# EAGLE design RobotWagenSchema (EAGLE 9.6.2)
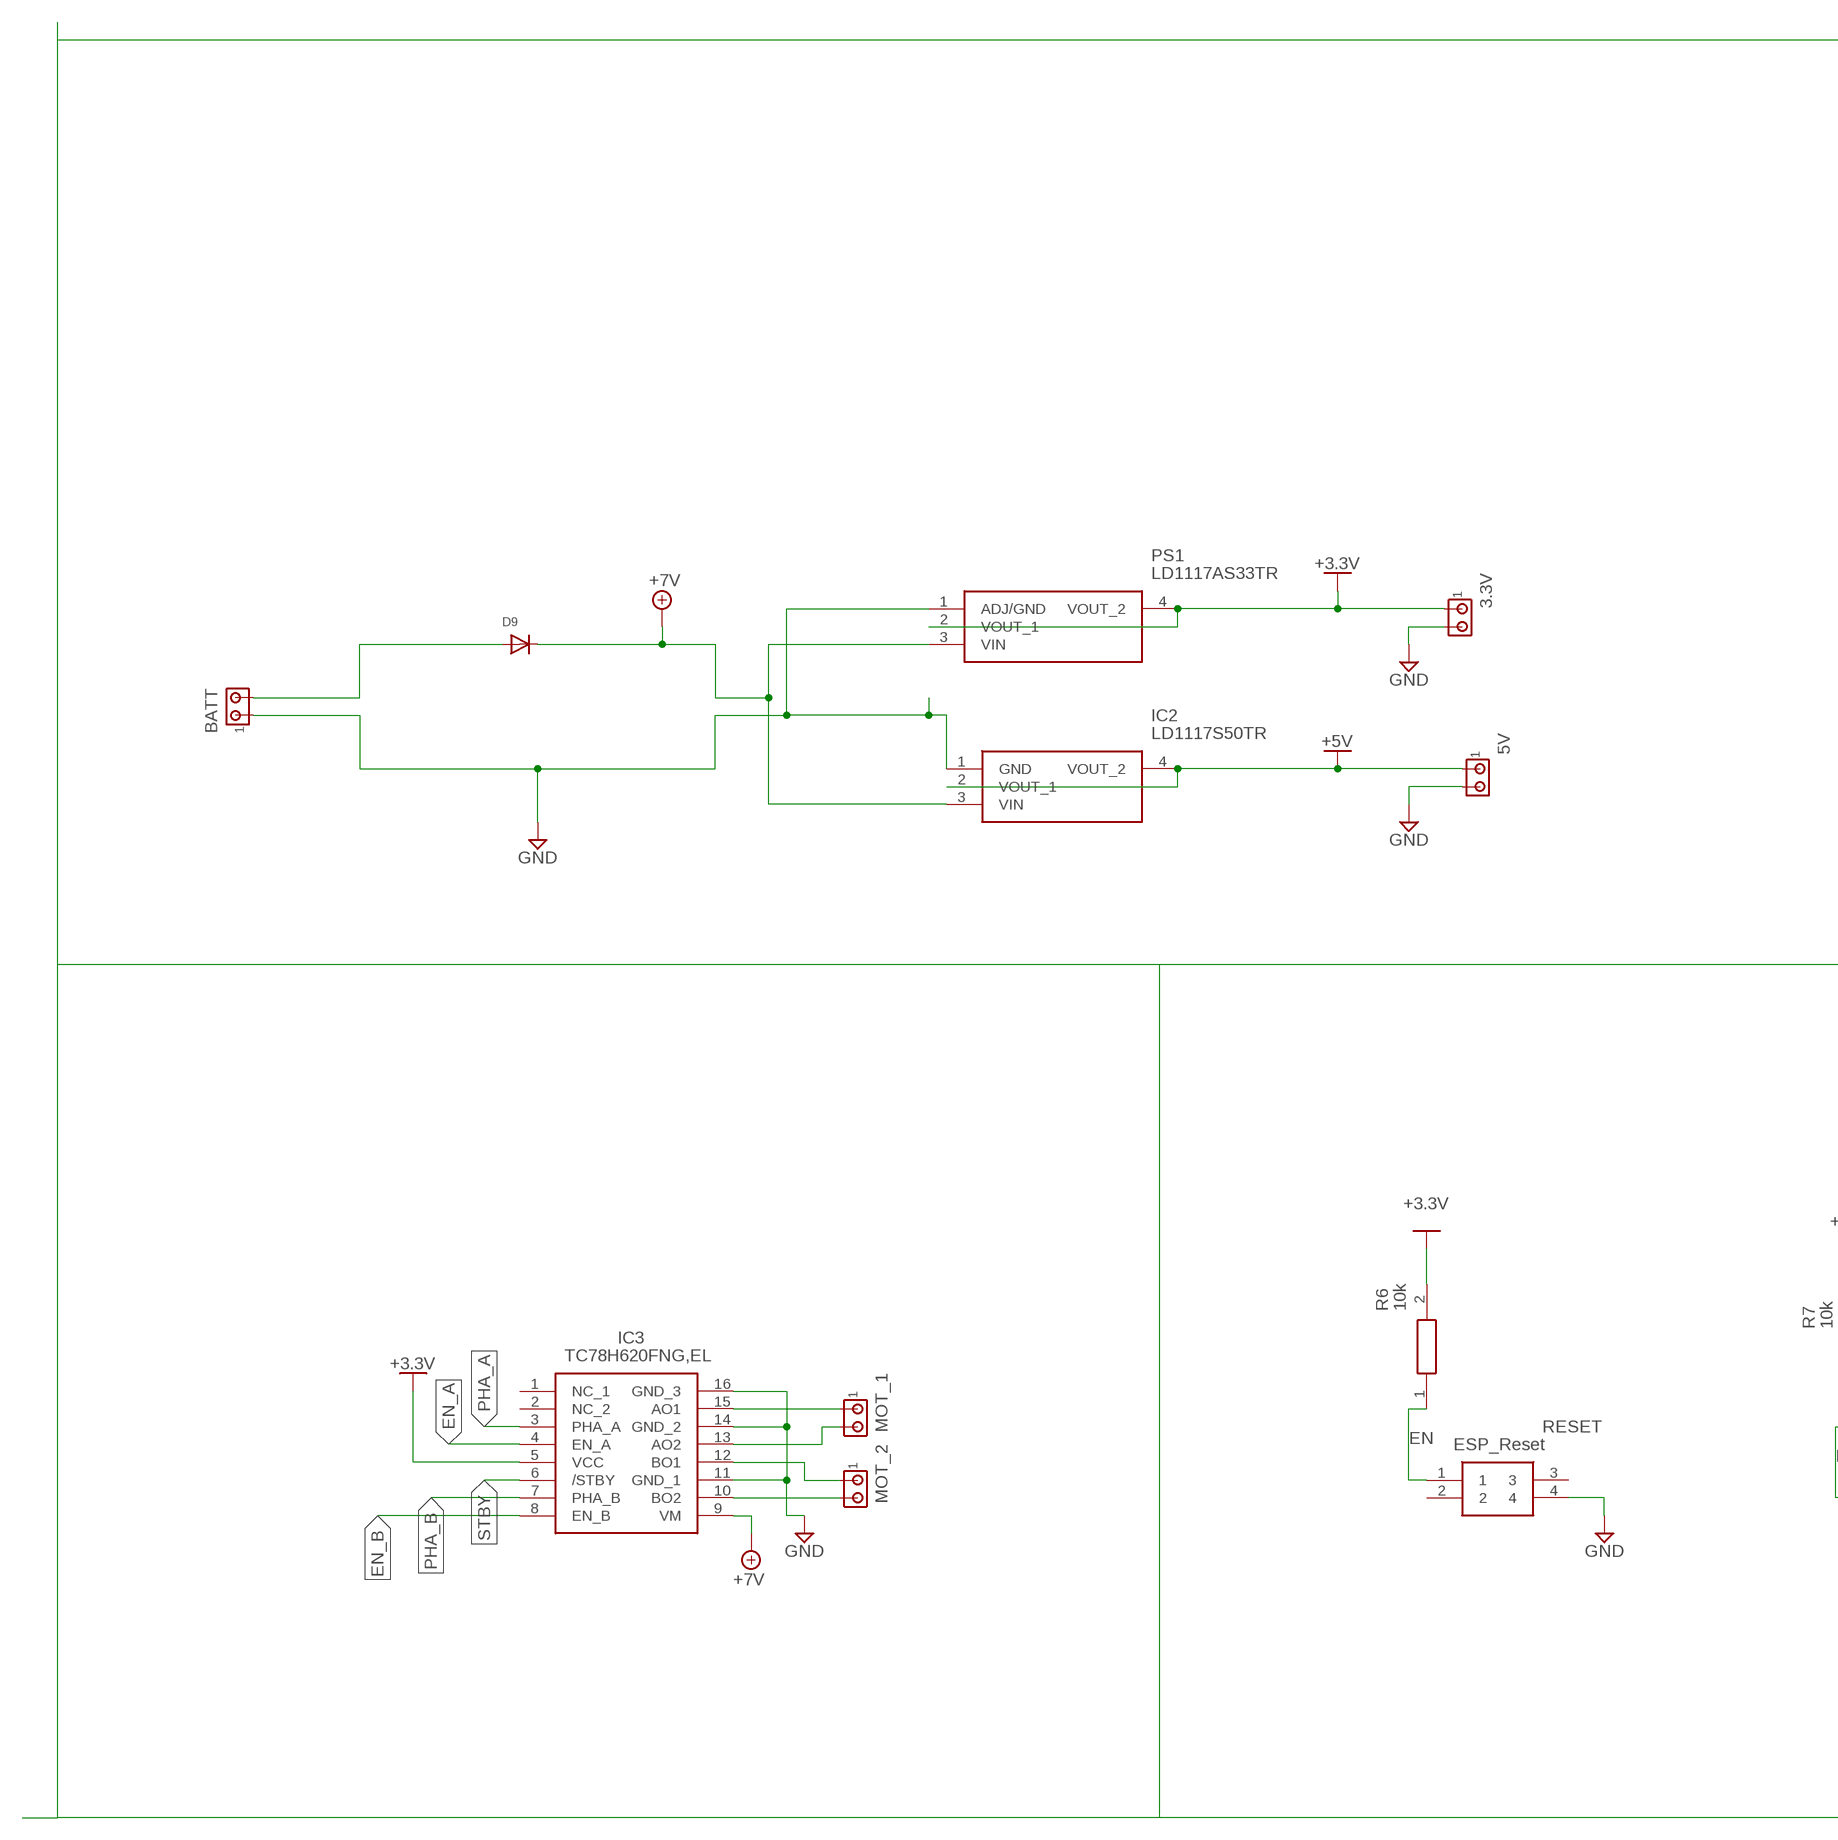
[diagram p0: schematic, sheet 1, part 1 of 2]
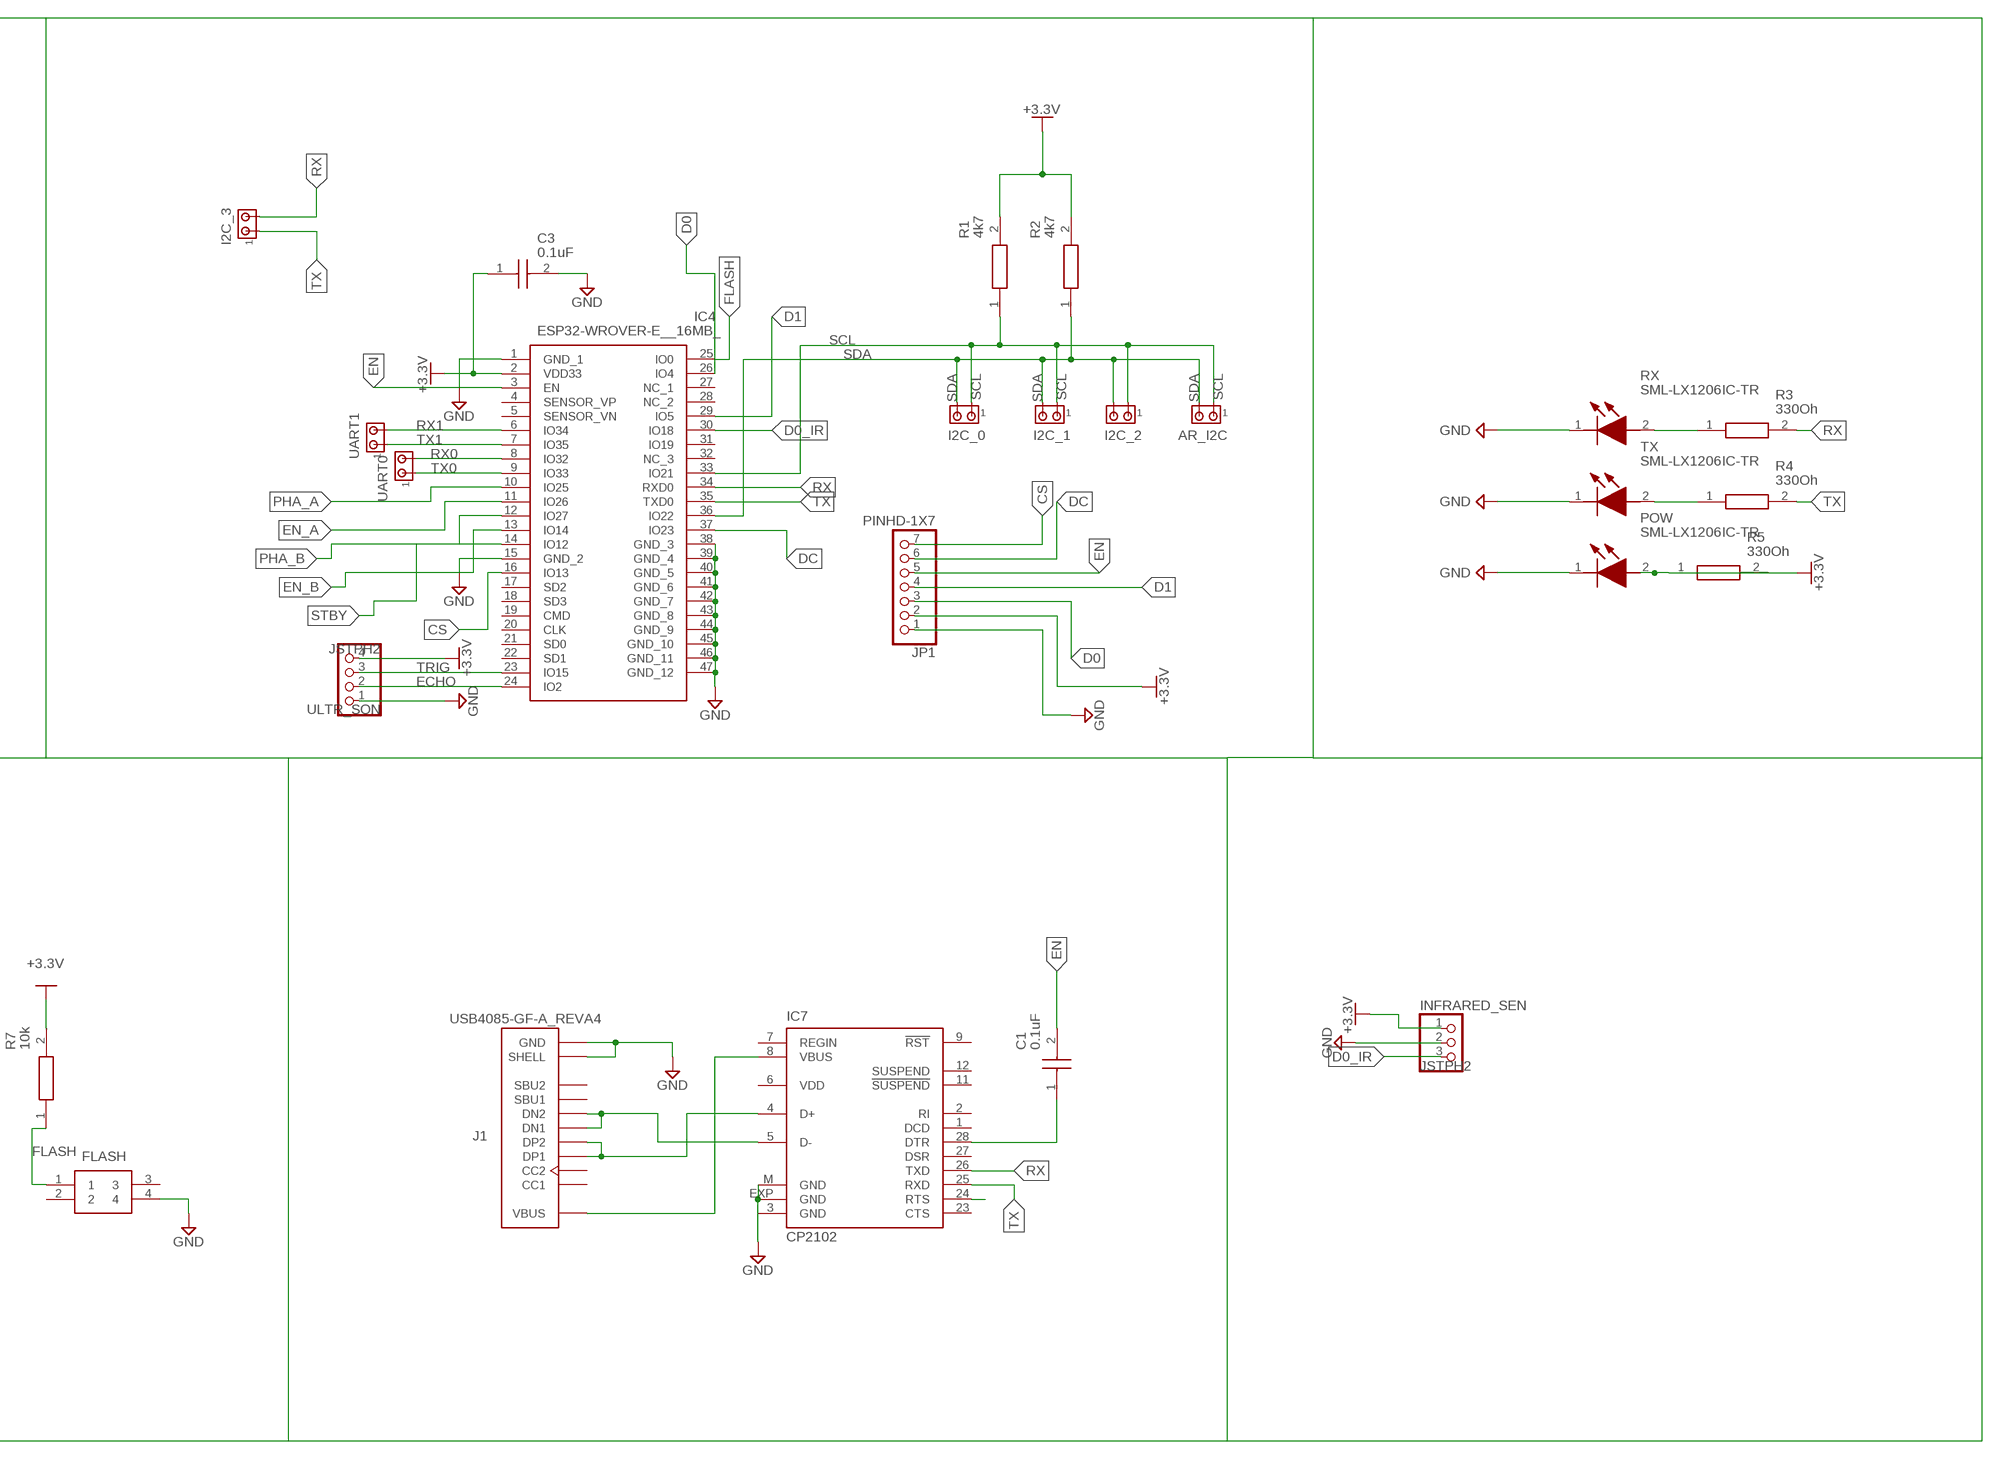
[diagram p1: schematic, sheet 1, part 2 of 2]

## Parts
3.3V  MTA02-156  [1X2MTA]
5V  MTA02-156  [1X2MTA]
AR_I2C  MTA02-156  [1X2MTA]
BATT  MTA02-156  [1X2MTA]
C1  0.1uF  GRM21BR71H104JA01L  [CAPC2012X145N]
C3  0.1uF  GRM21BR71H104JA01L  [CAPC2012X145N]
D9  DIODESMA  [SMADIODE]
FLASH  ESP_FL  430182050816  [430182070816]
I2C_0  MTA02-156  [1X2MTA]
I2C_1  MTA02-156  [1X2MTA]
I2C_2  MTA02-156  [1X2MTA]
I2C_3  MTA02-156  [1X2MTA]
IC2  LD1117S50TR  [SOT230P700X190-4N]
IC3  TC78H620FNG,EL  [SOP65P640X160-16N]
IC4  ESP32-WROVER-E__16MB_  [ESP32WROVERE16MB]
IC7  CP2102  [MLP28]
INFRARED_SEN  JSTPH2  [JSTPH2]
J1  USB4085-GF-A_REVA4  [GCT_USB4085-GF-A_REVA4]
JP1  PINHD-1X7  [1X07]
MOT_1  MTA02-156  [1X2MTA]
MOT_2  MTA02-156  [1X2MTA]
POW  SML-LX1206IC-TR  [SMLLX1206ICTR]
PS1  LD1117AS33TR  [SOT230P700X190-4N]
R1  4k7  WF08P473JTL  [RESC2012X65N]
R2  4k7  WF08P473JTL  [RESC2012X65N]
R3  330Oh  MCWR08X3301FTL  [RESC2012X65N]
R4  330Oh  MCWR08X3301FTL  [RESC2012X65N]
R5  330Oh  MCWR08X3301FTL  [RESC2012X65N]
R6  10k  WF08P473JTL  [RESC2012X65N]
R7  10k  WF08P473JTL  [RESC2012X65N]
RESET  ESP_Reset  430182050816  [430182070816]
RX  SML-LX1206IC-TR  [SMLLX1206ICTR]
TX  SML-LX1206IC-TR  [SMLLX1206ICTR]
UART0  MTA02-156  [1X2MTA]
UART1  MTA02-156  [1X2MTA]
ULTR_SON  JSTPH2  [JSTPH2]

## Nets
+3.3V [pow]: 3.3V.1 C3.1 IC3.5(VCC) IC4.2(VDD33) INFRARED_SEN.1 JP1.2 POW.2(A) PS1.2(VOUT_1) PS1.4(VOUT_2) R1.2 R2.2 R5.1 R5.2 R6.2 R7.2 ULTR_SON.4
+5V [pow]: 5V.1 IC2.2(VOUT_1) IC2.4(VOUT_2)
+7V [pow]: D9.C IC2.3(VIN) IC3.9(VM) PS1.3(VIN)
CS: IC4.16(IO13) JP1.7
D0: IC4.26(IO4) JP1.3
D0_IR: IC4.30(IO18) INFRARED_SEN.3
D1: IC4.29(IO5) JP1.4
DC: IC4.37(IO23) JP1.6
ECHO: IC4.24(IO2) ULTR_SON.2
EN: C1.2 IC4.3(EN) JP1.5 R6.1 RESET.1
EN_A: IC3.4(EN_A) IC4.11(IO26)
EN_B: IC3.8(EN_B) IC4.13(IO14)
FLASH: FLASH.1 IC4.25(IO0) R7.1
GND [pow]: 3.3V.2 5V.2 BATT.1 C3.2 FLASH.4 IC2.1(GND) IC3.11(GND_1) IC3.14(GND_2) IC3.16(GND_3) IC4.1(GND_1) IC4.15(GND_2) IC4.38(GND_3) IC4.39(GND_4) IC4.40(GND_5) IC4.41(GND_6) IC4.42(GND_7) IC4.43(GND_8) IC4.44(GND_9) IC4.45(GND_10) IC4.46(GND_11) IC4.47(GND_12) IC7.3(GND) IC7.EXP(GND) IC7.M(GND) INFRARED_SEN.2 J1.A1(GND) J1.A12(GND) J1.B1(GND) J1.B12(GND) J1.P1(SHELL) J1.P2(SHELL) J1.P3(SHELL) J1.P4(SHELL) JP1.1 POW.1(K) PS1.1(ADJ/GND) RESET.4 RX.1(K) TX.1(K) ULTR_SON.1
N$1: BATT.2 D9.A
N$3: IC7.24(RTS)
N$5: C1.1 IC7.28(DTR)
N$6: IC3.15(AO1) MOT_1.1
N$7: IC3.13(AO2) MOT_1.2
N$9: IC7.5(D-) J1.A7(DN1) J1.B7(DN2)
N$10: IC3.10(BO2) MOT_2.2
N$11: IC3.12(BO1) MOT_2.1
N$21: R3.1 RX.2(A)
N$25: IC7.4(D+) J1.A6(DP1) J1.B6(DP2)
N$27: IC7.8(VBUS) J1.A4(VBUS) J1.A9(VBUS) J1.B4(VBUS) J1.B9(VBUS)
PHA_A: IC3.3(PHA_A) IC4.10(IO25)
PHA_B: IC3.7(PHA_B) IC4.12(IO27)
RX: I2C_3.2 IC4.34(RXD0) IC7.26(TXD) R3.2
RX0: IC4.8(IO32) UART0.2
RX1: IC4.6(IO34) UART1.2
SCL: AR_I2C.1 I2C_0.1 I2C_1.1 I2C_2.1 IC4.33(IO21) R1.1
SDA: AR_I2C.2 I2C_0.2 I2C_1.2 I2C_2.2 IC4.36(IO22) R2.1
STBY: IC3.6(/STBY) IC4.14(IO12)
TRIG: IC4.23(IO15) ULTR_SON.3
TX: I2C_3.1 IC4.35(TXD0) IC7.25(RXD) R4.1 R4.2 TX.2(A)
TX0: IC4.9(IO33) UART0.1
TX1: IC4.7(IO35) UART1.1
Unconnected: FLASH.2 FLASH.3 IC3.1(NC_1) IC3.2(NC_2) IC4.4(SENSOR_VP) IC4.5(SENSOR_VN) IC4.17(SD2) IC4.18(SD3) IC4.19(CMD) IC4.20(CLK) IC4.21(SD0) IC4.22(SD1) IC4.27(NC_1) IC4.28(NC_2) IC4.31(IO19) IC4.32(NC_3) IC7.1(DCD) IC7.2(RI) IC7.7(REGIN) IC7.9(!RST) IC7.11(!SUSPEND) IC7.12(SUSPEND) IC7.23(CTS) IC7.27(DSR) J1.A5(CC1) J1.A8(SBU1) J1.B5(CC2) J1.B8(SBU2) RESET.2 RESET.3

## Power pins joined to a net without a drawn wire
VDD: IC7.6(VDD)

## Library data of the parts
3.3V 5V AR_I2C BATT I2C_0 I2C_1-I2C_3 MOT_1 MOT_2 UART0 UART1 = con-amp:MTA02-156: AMP connector
C1 C3 = GRM21BR71H104JA01L:GRM21BR71H104JA01L: Multilayer Ceramic Capacitors MLCC - SMD/SMT 0805 0.1uF 50volts X7R 5% Source: Datasheet <https://datasheet.datasheetarchive.com/originals/distributors/DKDS-10/192129.pdf>; ARROW_PART_NUMBER: GRM21BR71H104JA01L; ARROW_PRICE-STOCK: https://www.arrow.com/en/products/grm21br71h104ja01l/murata-manufacturing; DESCRIPTION: Multilayer Ceramic Capacitors MLCC - SMD/SMT 0805 0.1uF 50volts X7R 5%; HEIGHT: 1.45mm; MANUFACTURER_NAME: Murata Electronics; MANUFACTURER_PART_NUMBER: GRM21BR71H104JA01L; MOUSER_PART_NUMBER: 81-GRM21BR71H104JA01; MOUSER_PRICE-STOCK: https://www.mouser.co.uk/ProductDetail/Murata-Electronics/GRM21BR71H104JA01L?qs=JovLnzPPZAIJJ5OSotNa3Q%3D%3D
D9 = adafruit:DIODE: Diode SMADIODE - SMA Surface Mount Package 20V 1A Schottky Diode Digikey: 641-1014-6-ND DO-1N4148 - Through Hole Small Current Diode SOD-123 20V 1 A (.5mV Vf) Schottky Diode - Digikey: MBRX120TPMSCT-ND SOD-323 10V 570mA (.38mV Vf, 3ns) Schottky Diode - Digikey: ZLLS410CT-ND SOD-523 30V 30mA Schottky Diode (RB751S-40TE61) - Digikey: RB751S-40TE61CT-ND SOT23-R/W - SOT23 Package (R = Solder Paste/Reflow Ovens, W = Hand-Soldering) BAT54Film 40V 300mA - Digikey: 497-7162-1-ND
FLASH RESET = 430182050816:430182050816: Black Tactile Tactile Switch, NO 50 mA 1.6mm Surface Mount Source: Datasheet <http://katalog.we-online.de/em/datasheet/4301x2xxx8x6.pdf>; DESCRIPTION: Black Tactile Tactile Switch, NO 50 mA 1.6mm Surface Mount; HEIGHT: mm; MANUFACTURER_NAME: Wurth Elektronik; MANUFACTURER_PART_NUMBER: 430182050816; MOUSER_PART_NUMBER: 710-430182050816; MOUSER_PRICE-STOCK: https://www.mouser.co.uk/ProductDetail/Wurth-Elektronik/430182050816?qs=wr8lucFkNMUyle0jQPgWGw%3D%3D
IC2 = LD1117S50TR:LD1117S50TR: LDO Voltage Regulators 5.0V 0.8A Positive Source: Datasheet <https://datasheet.lcsc.com/szlcsc/STMicroelectronics-LD1117S50TR_C134077.pdf>; ARROW_PART_NUMBER: LD1117S50TR; ARROW_PRICE-STOCK: https://www.arrow.com/en/products/ld1117s50tr/stmicroelectronics?region=nac; DESCRIPTION: LDO Voltage Regulators 5.0V 0.8A Positive; HEIGHT: 1.9mm; MANUFACTURER_NAME: STMicroelectronics; MANUFACTURER_PART_NUMBER: LD1117S50TR; MOUSER_PART_NUMBER: 511-LD1117S50; MOUSER_PRICE-STOCK: https://www.mouser.co.uk/ProductDetail/STMicroelectronics/LD1117S50TR?qs=eQN2Ig5lfEwsh0kTXN%2FkTg%3D%3D
IC3 = TC78H620FNG_EL:TC78H620FNG,EL: Motor / Motion / Ignition Controllers & Drivers Brush Motor Driver IC 18V 1A Source: Datasheet <https://www.mouser.com/datasheet/2/408/TC78H620FNG_datasheet_en_20161125-1138306.pdf>; ARROW_PART_NUMBER: TC78H620FNG,EL; ARROW_PRICE-STOCK: https://www.arrow.com/en/products/tc78h620fngel/toshiba?region=nac; DESCRIPTION: Motor / Motion / Ignition Controllers & Drivers Brush Motor Driver IC 18V 1A; HEIGHT: 1.6mm; MANUFACTURER_NAME: Toshiba; MANUFACTURER_PART_NUMBER: TC78H620FNG,EL; MOUSER_PART_NUMBER: 757-TC78H620FNGEL; MOUSER_PRICE-STOCK: https://www.mouser.co.uk/ProductDetail/Toshiba/TC78H620FNGEL?qs=gt1LBUVyoHkIiKQSc8wkDw%3D%3D
IC4 = ESP32-WROVER-E__16MB_:ESP32-WROVER-E__16MB_: WiFi Modules (802.11) PCB Antenna Source: Datasheet <https://www.espressif.com/sites/default/files/documentation/esp32-wrover_datasheet_en.pdf>; DESCRIPTION: WiFi Modules (802.11) PCB Antenna; HEIGHT: 3.4mm; MANUFACTURER_NAME: Espressif Systems; MANUFACTURER_PART_NUMBER: ESP32-WROVER-E (16MB); MOUSER_PART_NUMBER: 356-ESP32WRVE22864PC; MOUSER_PRICE-STOCK: https://www.mouser.co.uk/ProductDetail/Espressif-Systems/ESP32-WROVER-E-16MB?qs=GBLSl2Akirv1e4kp%252BlJr4g%3D%3D
IC7 = silabs:CP210*: Single-Chip USB to UART Bridge Source: www.silabs.com .. CP2101.pdf / cp2102.pdf; MF: FARNELL; MPN: CP2102-GM; OC_FARNELL: 9282130; OC_NEWARK: 30K5635
INFRARED_SEN = jstph3:JSTPH2
J1 = USB4085-GF-A_REVA4:USB4085-GF-A_REVA4: USB 2.0 Type C Receptacle Dip Type, PCB Top Mount Check availability <https://pricing.snapeda.com/parts/USB4085-GF-A/Global%20Connector%20Technology/view-part?ref=eda>; AVAILABILITY: In Stock; DESCRIPTION: USB-C (USB TYPE-C) USB 2.0 Receptacle Connector 24 (16+8 Dummy) Position Through Hole, Right Angle, low cost, 3.46mm profile, 16 pin, horizontal, Top mount; MF: Global Connector Technology; MP: USB4085-GF-A; PACKAGE: None; PRICE: None; PURCHASE-URL: https://pricing.snapeda.com/search/part/USB4085-GF-A/?ref=eda
JP1 = Connector:PINHD-1X7: PIN HEADER; CATEGORY: CONNECTOR; SUB-CATEGORY: PIN-HEADER
POW RX TX = SML-LX1206IC-TR:SML-LX1206IC-TR: Standard LEDs - SMD 1206 Red Source: Datasheet <http://www.farnell.com/datasheets/1856081.pdf>; ARROW_PART_NUMBER: SML-LX1206IC-TR; ARROW_PRICE-STOCK: https://www.arrow.com/en/products/sml-lx1206ic-tr/lumex?region=nac; DESCRIPTION: Standard LEDs - SMD 1206 Red; HEIGHT: 1mm; MANUFACTURER_NAME: Lumex; MANUFACTURER_PART_NUMBER: SML-LX1206IC-TR; MOUSER_PART_NUMBER: 696-SML-LX1206IC; MOUSER_PRICE-STOCK: https://www.mouser.co.uk/ProductDetail/Lumex/SML-LX1206IC-TR?qs=vlknNxX0Xzgi3577r8SRWg%3D%3D
PS1 = LD1117AS33TR:LD1117AS33TR: STMICROELECTRONICS - LD1117AS33TR - Fixed LDO Voltage Regulator, 5.3V to 10V, 1.15V Dropout, 3.3Vout, 1Aout, SOT-223-3 Source: Datasheet <https://4donline.ihs.com/images/VipMasterIC/IC/SGST/SGSTS49356/SGSTS49356-1.pdf?hkey=6D3A4C79FDBF58556ACFDE234799DDF0>; ARROW_PART_NUMBER: LD1117AS33TR; ARROW_PRICE-STOCK: https://www.arrow.com/en/products/ld1117as33tr/stmicroelectronics?region=nac; DESCRIPTION: STMICROELECTRONICS - LD1117AS33TR - Fixed LDO Voltage Regulator, 5.3V to 10V, 1.15V Dropout, 3.3Vout, 1Aout, SOT-223-3; HEIGHT: 1.9mm; MANUFACTURER_NAME: STMicroelectronics; MANUFACTURER_PART_NUMBER: LD1117AS33TR; MOUSER_PART_NUMBER: 511-LD1117AS33; MOUSER_PRICE-STOCK: https://www.mouser.co.uk/ProductDetail/STMicroelectronics/LD1117AS33TR?qs=C3bf%2FVrkE5CoDDd7wyn%252BaQ%3D%3D
R1 R2 R6 R7 = WF08P473JTL:WF08P473JTL: WF08P473JTL Source: Datasheet <https://4donline.ihs.com/images/VipMasterIC/IC/WATC/WATCS00985/WATCS00985-1.pdf?hkey=EF798316E3902B6ED9A73243A3159BB0>; DESCRIPTION: WF08P473JTL; HEIGHT: 0.65mm; MANUFACTURER_NAME: ROYALOHM; MANUFACTURER_PART_NUMBER: WF08P473JTL
R3-R5 = MCWR08X3301FTL:MCWR08X3301FTL: RES, 3K3, 1%, 0.125W, 0805, THICK FILM Source: Datasheet <http://www.farnell.com/datasheets/2563624.pdf>; DESCRIPTION: RES, 3K3, 1%, 0.125W, 0805, THICK FILM; HEIGHT: 0.65mm; MANUFACTURER_NAME: MULTICOMP; MANUFACTURER_PART_NUMBER: MCWR08X3301FTL
ULTR_SON = jstph4:JSTPH2

## Net classes
1 pow: width 0.381 mm, clearance 0.381 mm

## Board
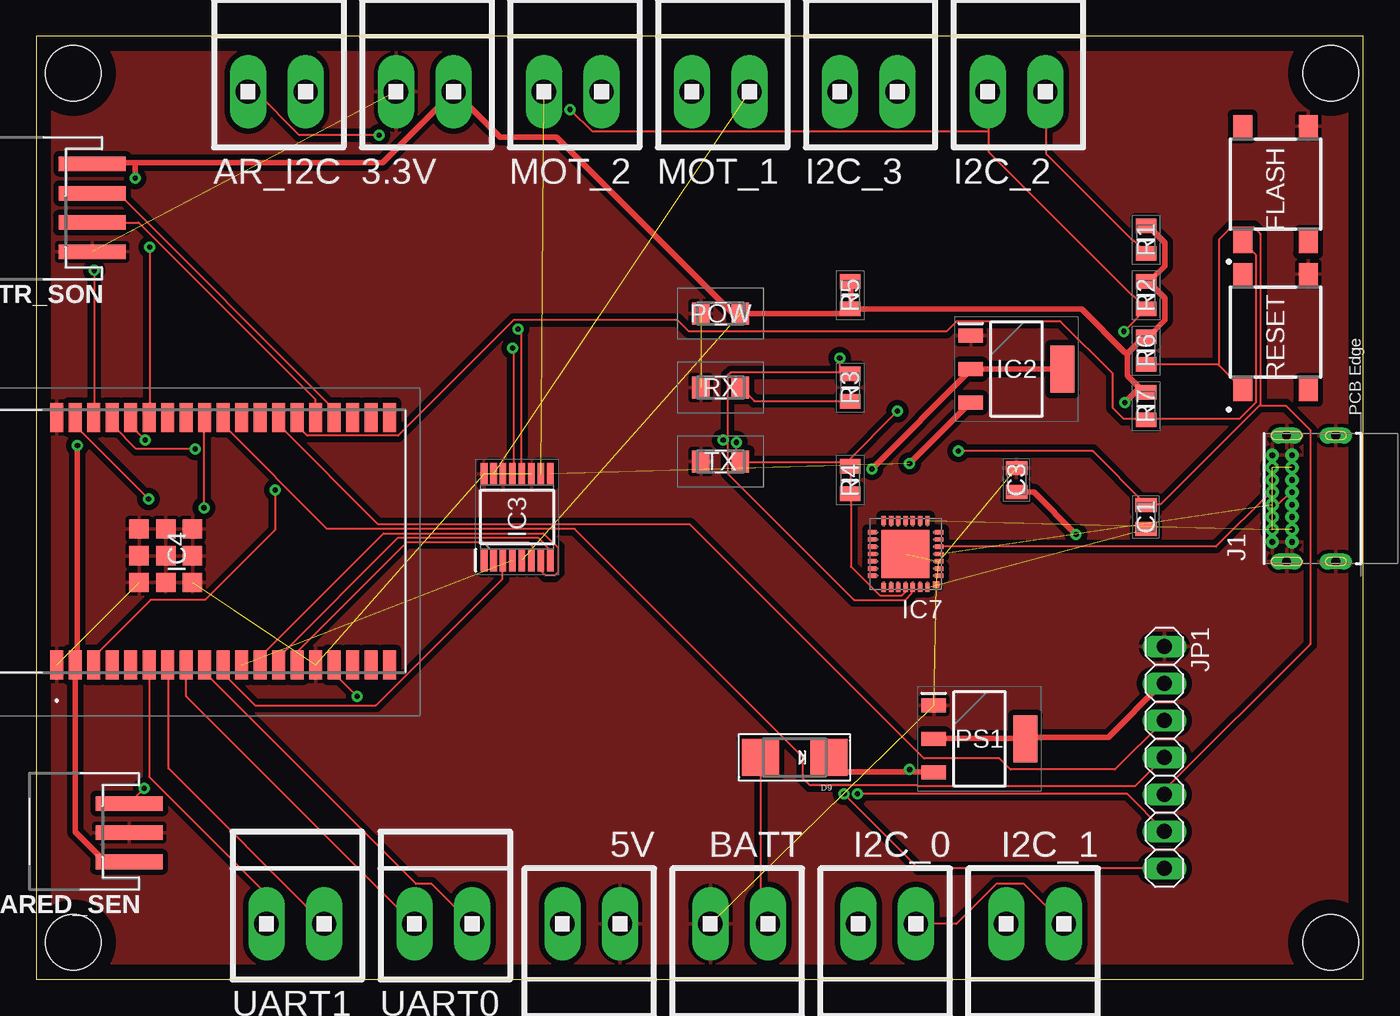
[diagram p2: board, top side]
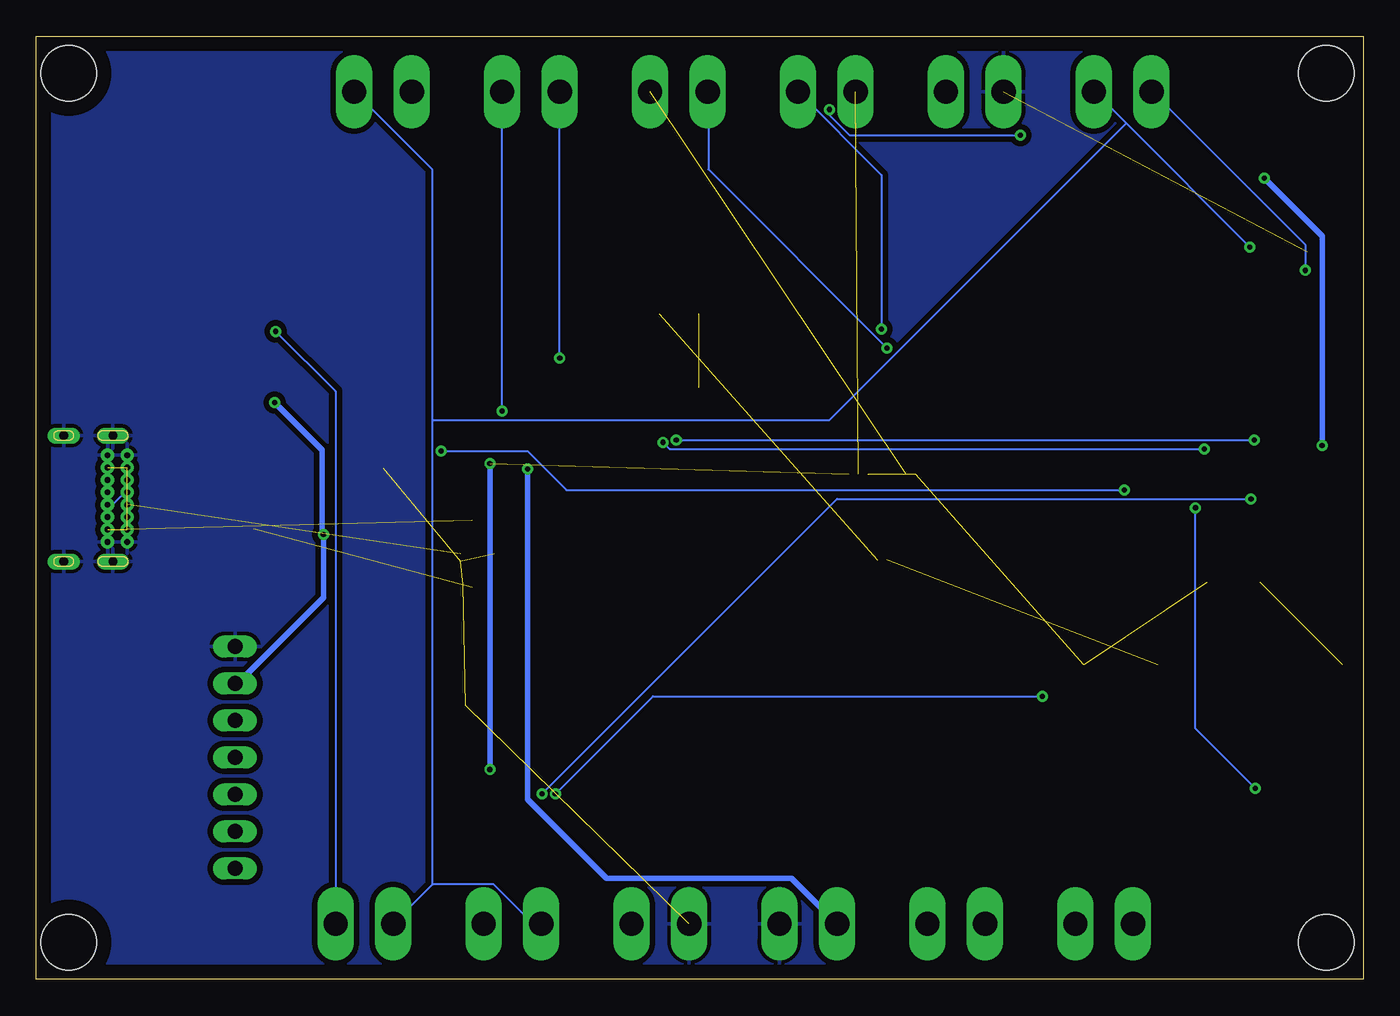
[diagram p3: board, bottom side, seen from below]

Size 91.11 x 64.76 mm. Coordinates in mm from the lower left corner, seen from the top.
Outline: 0,0 91.11,0 91.11,64.76 0,64.76 0,0
Copper layers (1*16): Top 0.035mm / dielectric 1.5mm / Bottom 0.035mm
Design rules "default": minimum track width 6mil, minimum drill 0.35mm, track to track 6mil, track to pad 6mil, pad to pad 6mil, via to via 6mil, smd to smd 6mil, copper to edge 40mil, drill to drill 6mil, minimum pad ring 10mil, minimum via ring 8mil, stop-mask expansion 4mil, vias tented up to drill 0mil, thermal gap 10mil
Holes 3.81 mm at 2.54,62.23 88.9,62.23 88.9,2.54 2.54,2.54

### Footprints (pad centres in the part's own frame; a part is rotated, then mirrored left to right if it is on the bottom)
1X2MTA = drill 1.676 long: 1 1.981,0; 2 -1.981,0
CAPC2012X145N = smd 0.97 x 1.47: 1 -0.83,0; 2 0.83,0
SMADIODE = smd 2.54 x 2.54: A 2.349,0; C -2.349,0
430182070816 = smd 1.55 x 1.3: 1 -3.975,2.25; 2 -3.975,-2.25; 3 3.975,2.25; 4 3.975,-2.25
SOT230P700X190-4N = smd 1.65 x 0.95: 1 -3.15,2.3; 2 -3.15,0; 3 -3.15,-2.3 | smd 1.65 x 3.25: 4 3.15,0
SOP65P640X160-16N = smd 1.525 x 0.45: 1 -2.962,2.275; 2 -2.962,1.625; 3 -2.962,0.975; 4 -2.962,0.325; 5 -2.962,-0.325; 6 -2.962,-0.975; 7 -2.962,-1.625; 8 -2.962,-2.275; 9 2.962,-2.275; 10 2.962,-1.625; 11 2.962,-0.975; 12 2.962,-0.325; 13 2.962,0.325; 14 2.962,0.975; 15 2.962,1.625; 16 2.962,2.275
ESP32WROVERE16MB = smd 2 x 0.9: 1 0,7.5; 2 0,6.23; 3 0,4.96; 4 0,3.69; 5 0,2.42; 6 0,1.15; 7 0,-0.12; 8 0,-1.39; 9 0,-2.66; 10 0,-3.93; 11 0,-5.2; 12 0,-6.47; 13 0,-7.74; 14 0,-9.01; 15 0,-10.28; 16 0,-11.55; 17 0,-12.82; 18 0,-14.09; 19 0,-15.36; 20 17,-15.36; 21 17,-14.09; 22 17,-12.82; 23 17,-11.55; 24 17,-10.28; 25 17,-9.01; 26 17,-7.74; 27 17,-6.47; 28 17,-5.2; 29 17,-3.93; 30 17,-2.66; 31 17,-1.39; 32 17,-0.12; 33 17,1.15; 34 17,2.42; 35 17,3.69; 36 17,4.96; 37 17,6.23; 38 17,7.5 | smd 1.33 x 1.33: 39 5.665,1.835; 40 7.5,1.835; 41 9.335,1.835; 42 5.665,0; 43 7.5,0; 44 9.335,0; 45 5.665,-1.835; 46 7.5,-1.835; 47 9.335,-1.835
MLP28 = smd 0.6 x 0.3: 1 -2.3,1.5; 2 -2.3,1; 3 -2.3,0.5; 4 -2.3,0; 5 -2.3,-0.5; 6 -2.3,-1; 7 -2.3,-1.5; 15 2.3,-1.5; 16 2.3,-1; 17 2.3,-0.5; 18 2.3,0; 19 2.3,0.5; 20 2.3,1; 21 2.3,1.5 | smd 0.3 x 0.6: 8 -1.5,-2.3; 9 -1,-2.3; 10 -0.5,-2.3; 11 0,-2.3; 12 0.5,-2.3; 13 1,-2.3; 14 1.5,-2.3; 22 1.5,2.3; 23 1,2.3; 24 0.5,2.3; 25 0,2.3; 26 -0.5,2.3; 27 -1,2.3; 28 -1.5,2.3 | smd 3.3 x 3.3: EXP 0,0 | smd 0.435 x 0.435: M -2.103,2.103
JSTPH2 = smd 1 x 4.6: 1 -2.095,-3.824; 2 -0.095,-3.824; 3 1.913,-3.839
GCT_USB4085-GF-A_REVA4 = drill 0.4 pad 0.65: A1 -2.975,4.025; A4 -2.125,4.025; A5 -1.275,4.025; A6 -0.425,4.025; A7 0.425,4.025; A8 1.275,4.025; A9 2.125,4.025; A12 2.975,4.025; B1 2.975,2.675; B4 2.125,2.675; B5 1.275,2.675; B6 0.425,2.675; B7 -0.425,2.675; B8 -1.275,2.675; B9 -2.125,2.675; B12 -2.975,2.675 | drill 0.6 pad 1.108 long: P1 -4.325,3.045; P2 4.325,3.045; P3 4.325,-0.335; P4 -4.325,-0.335
1X07 = drill 1.016 long: 1 -7.62,0; 2 -5.08,0; 3 -2.54,0; 4 0,0; 5 2.54,0; 6 5.08,0; 7 7.62,0
SMLLX1206ICTR = smd 1.2 x 1.5: 1 -1.35,0; 2 1.35,0
RESC2012X65N = smd 1 x 1.4: 1 -0.95,0; 2 0.95,0
JSTPH2' = smd 1 x 4.6: 1 -2.095,-3.824; 2 -0.095,-3.824; 3 1.913,-3.839; 4 3.945,-3.839

### Placement (x,y rotation side)
3.3V  26.67,60.96 0 top
5V  38.1,3.81 180 top
AR_I2C  16.51,60.96 0 top
BATT  48.26,3.81 180 top
C1  76.2,31.75 90 top
C3  67.31,34.29 90 top
D9  52.07,15.24 180 top
FLASH  85.09,54.61 90 top
I2C_0  58.42,3.81 180 top
I2C_1  68.58,3.81 180 top
I2C_2  67.31,60.96 0 top
I2C_3  57.15,60.96 0 top
IC2  67.31,41.91 0 top
IC3  33.02,31.75 90 top
IC4  8.89,21.59 90 top
IC7  59.69,29.21 180 top
INFRARED_SEN  2.54,10.16 90 top
J1  88.9,33.02 90 top
JP1  77.47,15.24 270 top
MOT_1  46.99,60.96 0 top
MOT_2  36.83,60.96 0 top
POW  46.99,45.72 0 top
PS1  64.77,16.51 0 top
R1  76.2,50.8 90 top
R2  76.2,46.99 90 top
R3  55.88,40.64 90 top
R4  55.88,34.29 90 top
R5  55.88,46.99 270 top
R6  76.2,43.18 90 top
R7  76.2,39.37 90 top
RESET  85.09,44.45 90 top
RX  46.99,40.64 0 top
TX  46.99,35.56 0 top
UART0  27.94,3.81 0 top
UART1  17.78,3.81 0 top
ULTR_SON  JSTPH2  [JSTPH2']  0,52.07 90 top

### Tracks (layer width: path | path; a pad name or v marks a point on that pad's centre or on a via)
+3.3V  (via drill 0.35)  (1 unrouted)
  Top 0.381: PS1.2 61.65,16.54 67.89,16.54 PS1.4 68.05,16.61 73.61,16.61 77.27,20.27 77.42,20.27 JP1.2 | v71.4,30.56 68.5,33.45 67.36,33.45 C3.1 | R5.2 55.93,46.1 55.93,47.93 R5.1 | R5.2 55.7,45.95 55.47,45.72 48.39,45.72 POW.2 48.16,45.8 47.78,45.8 35.74,57.84 31.85,57.84 28.8,60.88 3.3V.1 23.77,56.08 6.78,56.08 | 74.91,42.98 74.91,41.45 75.97,40.39 76.2,40.39 R7.2 75.67,40.54 v74.75,39.62 | 74.91,42.98 76.05,44.12 R6.2 76.35,44.12 77.5,45.26 77.5,46.79 76.35,47.93 R2.2 76.5,48.01 77.5,49 77.5,50.6 76.35,51.74 R1.2 | R5.2 56.08,46.02 71.78,46.02 74.75,43.05 74.91,42.98 | INFRARED_SEN.1 6.33,8.08 4.72,8.08 2.67,10.13 2.67,21.57 IC4.2 2.82,21.72 v2.82,36.65 | 6.78,56.08 3.89,56.08 ULTR_SON.4 | v6.78,55.02 6.78,55.93 6.78,56.08
  Bottom 0.381: JP1.2 77.42,20.34 77.27,20.34 71.4,26.21 v71.4,30.56 71.48,30.71 71.48,36.35 v74.75,39.62 | v2.82,36.65 2.82,51.05 v6.78,55.02
+5V  (via drill 0.35)
  Top 0.381: IC2.2 70.41,41.91 IC2.4 | IC2.2 | v57.38,35.05 64.08,41.76 IC2.2
  Bottom 0.381: v57.38,35.05 57.38,12.34 51.97,6.93 39.24,6.93 5V.1
+7V  (via drill 0.35)  (1 unrouted)
  Top 0.381: 59.97,14.25 55.47,14.25 54.48,15.24 D9.C | 59.97,14.25 61.57,14.25 PS1.3 | v59.97,35.43 64.08,39.55 IC2.3 | v59.97,14.4 59.97,14.25
  Bottom 0.381: v59.97,14.4 v59.97,35.43
CS  (via drill 0.35)
  Top 0.152: v22.02,19.43 20.5,20.95 20.5,21.57 IC4.16 | v55.47,12.72 60.58,7.62 77.42,7.62 JP1.7
  Bottom 0.152: v22.02,19.43 48.77,19.43 v55.47,12.72
D0
  Top 0.152: IC4.26 16.69,38.56 16.69,38.02 23.47,31.24 44.88,31.24 60.96,15.16 66.14,15.16 66.9,14.4 74.07,14.4 77.42,17.75 JP1.3
D0_IR  (via drill 0.35)
  Top 0.152: v11.51,32.38 11.51,38.56 IC4.30 | v7.39,13.11 6.4,12.12 INFRARED_SEN.3
  Bottom 0.152: v11.51,32.38 11.51,17.22 v7.39,13.11
D1
  Top 0.152: IC4.29 12.88,38.56 12.88,38.02 19.96,30.94 36.96,30.94 52.65,15.24 52.65,13.79 53.11,13.34 60.5,13.34 60.58,13.26 75.44,13.26 77.42,15.24 JP1.4
DC  (via drill 0.35)
  Top 0.152: v7.7,32.99 2.67,38.02 2.67,38.56 IC4.37 | v56.39,12.72 74.91,12.72 77.42,10.21 JP1.6
  Bottom 0.152: v7.7,32.99 36.12,32.99 v56.39,12.72
ECHO
  Top 0.152: IC4.24 19.13,38.63 19.13,39.85 7.01,51.97 3.89,51.97 ULTR_SON.2
EN  (via drill 0.35)
  Top 0.152: 81.19,42.18 82.83,40.54 RESET.1 | 81.19,42.18 81.15,42.22 76.2,42.22 R6.1 | 76.2,32.61 77.19,32.61 84.01,39.43 | 84.01,39.43 84.05,39.47 84.05,51.21 83.59,51.66 82.07,51.66 81.23,50.83 81.23,42.22 81.19,42.18 | 76.2,32.61 C1.2 76.2,32.61 | v16.38,33.6 16.38,30.86 11.58,26.06 7.85,26.06 3.96,22.17 3.96,21.64 IC4.3 | v63.32,36.27 72.54,36.27 76.2,32.61 | JP1.5 77.5,12.72 77.5,13.03 87.48,23.01 87.48,37.72 85.8,39.4 84.05,39.4 84.01,39.43
  Bottom 0.152: v16.38,33.6 54.71,33.6 57.38,36.27 v63.32,36.27
EN_A  (1 unrouted)
EN_B
  Top 0.152: IC3.8 35.28,28.8 35.28,29.49 34.44,30.33 24.84,30.33 16.69,22.17 16.69,21.64 IC4.13
FLASH
  Top 0.152: 76.2,38.48 82.6,38.48 83.74,39.62 83.74,49.76 82.91,50.6 FLASH.1 | 76.2,38.48 R7.1 76.2,38.48 | 76.2,38.48 74.68,38.48 73.91,39.24 73.91,41.6 70.33,45.19 63.17,45.19 62.48,44.5 44.81,44.5 44.04,45.26 32.77,45.26 24.84,37.34 18.59,37.34 17.91,38.02 17.91,38.56 IC4.25
GND  (12 unrouted)
  pour Top: 0,0 91.44,0 91.44,64.77 0,64.77
  pour Bottom: 0,0 91.44,0 91.44,64.77 0,64.77
N$1
  Top 0.152: D9.A 49.76,15.24 49.76,4.27 50.22,3.81 BATT.2
N$5  (1 unrouted)
N$6  (1 unrouted)
N$7  (via drill 0.35)
  Top 0.152: v32.69,43.36 32.77,43.28 32.77,34.75 IC3.13
  Bottom 0.152: v32.69,43.36 44.96,55.63 44.96,60.96 MOT_1.2
N$9
  Top 0.152: IC7.5 62.03,29.72 81,29.72 84.66,33.38 84.81,33.38 J1.A7
  Bottom 0.152: J1.B7 86.18,32.61 85.88,32.61 85.11,33.38 84.89,33.38 J1.A7
N$10  (1 unrouted)
N$11  (via drill 0.35)
  Top 0.152: v33.07,44.65 33.3,44.42 33.3,34.75 IC3.12
  Bottom 0.152: v33.07,44.65 33.07,55.24 38.79,60.96 MOT_2.1
N$21
  Top 0.152: R3.1 55.85,39.7 49.3,39.7 48.39,40.62 RX.2
N$25  (1 unrouted)
  Top 0.152: J1.A6 84.89,32.61 85.27,32.61 86.03,33.38 86.18,33.38 J1.B6
N$27  (4 unrouted)
PHA_A
  Top 0.152: IC3.3 32,28.73 32,27.51 23.32,18.82 15.01,18.82 12.88,20.95 12.88,21.57 IC4.10
PHA_B
  Top 0.152: IC3.7 34.67,28.73 34.67,28.04 34.98,27.74 35.59,27.74 35.81,27.96 35.81,29.64 34.82,30.63 23.85,30.63 15.39,22.17 15.39,21.64 IC4.12
RX  (via drill 0.35)
  Top 0.152: 47.47,37.03 47.47,41.45 47.7,41.68 55.17,41.68 | 47.47,37.03 47.47,34.75 56.16,26.06 59.66,26.06 60.12,26.52 60.12,26.9 IC7.26 | 55.17,41.68 55.78,41.68 55.85,41.6 R3.2 | v7.47,37.03 6.48,38.02 6.48,38.56 IC4.34 | 47.47,37.03 v47.17,37.03 | 55.17,41.68 v55.17,42.67
  Bottom 0.152: v47.17,37.03 v7.47,37.03 | v55.17,42.67 I2C_3.2
RX0
  Top 0.152: IC4.8 10.29,21.57 10.29,19.43 25.91,3.81 UART0.2
RX1
  Top 0.152: IC4.6 7.77,21.57 7.77,13.87 15.77,5.87 15.77,3.81 UART1.2
SCL  (via drill 0.35)
  Top 0.152: v7.77,50.29 7.77,38.63 IC4.33 | R1.1 76.2,49.91 75.36,50.75 75.29,50.75 69.34,56.69 69.34,60.96 I2C_2.1
  Bottom 0.152: 16.27,58.79 18.44,60.96 AR_I2C.1 | 16.27,58.79 v7.77,50.29 | I2C_1.1 63.89,6.51 | 63.89,6.51 63.86,6.55 59.74,6.55 57,3.81 56.46,3.81 I2C_0.1 | 63.93,38.41 63.93,55.63 69.27,60.96 I2C_2.1 | 63.93,38.41 63.93,6.55 63.89,6.51 | 63.93,38.41 36.65,38.41 16.31,58.75 16.27,58.79
SDA  (via drill 0.35)
  Top 0.152: v3.96,48.69 3.96,38.63 IC4.36 | I2C_1.2 67.82,6.55 65.91,6.55 63.17,3.81 60.43,3.81 I2C_0.2 | 65.38,58.22 65.38,60.96 I2C_2.2 | 65.38,58.22 65.38,56.84 75.29,46.94 75.36,46.94 76.2,46.1 R2.1 76.2,46.02 v74.68,44.5 | v23.55,57.99 18.06,57.99 15.09,60.96 14.55,60.96 AR_I2C.2 | v36.65,59.74 38.18,58.22 65.38,58.22
  Bottom 0.152: v3.96,48.69 3.96,50.44 14.48,60.96 AR_I2C.2 | I2C_1.2 70.56,40.39 v74.68,44.5 | v23.55,57.99 35.28,57.99 36.65,59.36 v36.65,59.74
STBY
  Top 0.152: IC3.6 34.06,28.8 34.06,29.72 33.76,30.02 25.45,30.02 17.91,22.48 17.91,21.64 IC4.14
TRIG
  Top 0.152: IC4.23 20.42,38.63 20.42,39.17 5.64,53.95 3.89,53.95 ULTR_SON.3
TX  (via drill 0.35)
  Top 0.152: IC7.25 59.66,26.9 59.66,26.59 59.44,26.36 57.91,26.36 55.93,28.35 55.93,33.3 R4.1 55.93,33.38 55.93,35.2 R4.2 | 55.63,35.51 48.39,35.51 TX.2 48.31,35.59 48.08,35.81 v48.08,36.88 | 55.63,35.51 55.85,35.28 R4.2 | v10.9,36.42 6.86,36.42 5.26,38.02 5.26,38.56 IC4.35 | 55.63,35.51 v59.13,39.01 | 55.63,35.51 R4.2
  Bottom 0.152: v10.9,36.42 47.62,36.42 v48.08,36.88 | v59.13,39.01 I2C_3.1
TX0
  Top 0.152: IC4.9 11.58,21.57 11.58,21.03 26.06,6.55 27.13,6.55 29.87,3.81 UART0.1
TX1
  Top 0.152: IC4.7 9.07,21.57 9.07,14.48 19.74,3.81 UART1.1